# Altium schematic sheet Блок4.SchDoc
size A4
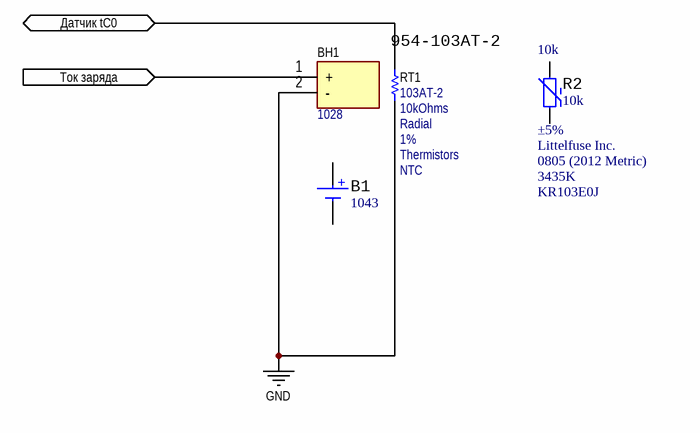
[diagram p0: Блок4.SchDoc]

## Parts
B1  1043  [KEYSTONE 1043]
BH1  1028  [1028]
R2  10k  Part Number: KR103E0J  B25/85: 3435K  Manufacturer: Littelfuse Inc.  Package / Case: 0805 (2012 Metric)  Resistance Tolerance: ±5%  [NTC 0805_2012]
RT1  103AT-2  Resistance: 10kOhms  Termination Style: Radial  Tolerance: 1%  Product Category: Thermistors  Type: NTC  Supplier Part Number 1: 954-103AT-2  [SEMI-103AT-2_V]

## Ports
Датчик tC0 (bidir), Ток заряда (in)

## Nets
GND: BH1.2(-) RT1.1
Датчик tC0: RT1.2 ; port Датчик tC0
Ток заряда: BH1.1(+) ; port Ток заряда

Not connected (* = marked no-connect by the designer): B1 1(+) 2(-); R2 1 2

## Library data of the parts
B1 = 1043: BATTERY HOLDER 18650 PC PIN; Manufacturer: Keystone Electronics; Battery Cell Size: 18650; Battery Type, Function: Cylindrical, Holder; Number of Cells: 1; Style: Holder (Open); Part Number: 1043; ComponentLink1Description: Datasheet; ComponentLink1URL: http://keyelco.com/userAssets/file/M65p27.pdf; ComponentLink2Description: DigiKey Link; ComponentLink2URL: http://digikey.com/product-detail/en/keystone-electronics/1043/36-1043-ND/2745669; Height Above Board: 0.585" (14.86mm); LastUpdated: 02.02.2020 9:19:56; Lifecycle Status: Active; Minimum Order: 1; Mounting Type: PCB, Through Hole; Operating Temperature: -50°C ~ 145°C; Packaging: Unknown; PartId: 2; Part Status: Active; Price: 2.58; Series: -; Supplier 1: DigiKey; Supplier Part Number 1: 36-1043-ND; Termination Style: PC Pin
BH1 = 1028: Undefined or Miscellaneous; Manufacturer_Name: Keystone Electronics; Datasheet Link: http://www.keyelco.com/product-pdf.cfm?p=929; Height: 15.49mm; Manufacturer_Part_Number: 1028; Mouser Part Number: 534-1028; Mouser Price/Stock: https://www.mouser.co.uk/ProductDetail/Keystone-Electronics/1028?qs=TMDrOSIpnUdoTBwO9TubhA%3D%3D; Arrow Part Number: 1028; Arrow Price/Stock: https://www.arrow.com/en/products/1028/keystone-electronics
R2 = KR103E0J: THERMISTOR NTC 10KOHM 3435K 0805; Power - Max: 300mW; ComponentLink1Description: Datasheet; ComponentLink1URL: https://www.littelfuse.com/~/media/electronics/datasheets/surface_mount_thermistors/littelfuse_surface_mount_thermistors_end_banded_chip_thermistors_0805_kr_datasheet.pdf.pdf; ComponentLink2Description: DigiKey Link; ComponentLink2URL: http://digikey.com/product-detail/en/littelfuse-inc/KR103E0J/KR103E0J-ND/4923947; LastUpdated: 30.08.2020 21:02:56; Lifecycle Status: Active; Minimum Order: 500; Mounting Type: Surface Mount; Packaging: Bulk; PartId: 1290; Price: 0.48; Resistance in Ohms @ 25°C: 10k; Series: KR; Supplier 1: DigiKey; Supplier Part Number 1: KR103E0J-ND; Value: 10k
RT1 = CMP-2000-05824-1: Precision NTC Thermistor, 10 kOhm, +/- 1%, 10 mW, -50 to 110 degC, 2-Pin THD, RoHS, Bulk; Brand: Semitec; Packaging: Bulk; Mounting Technology: ThroughHole; Operating Temperature Range: -50Cto+110C; Lead Spacing: 2.54mm; RoHS: True; Manufacturer URL: http://www.semitec.co.jp/english/; Datasheet Version: Rev. A, 02/2007; Length: 17mm; Manufacturer: Semitec; Datasheet URL: https://www.rapidonline.com/pdf/61-0500e.pdf; Series: AT; Package Description: 2-Pin Through Hole Device, Body Width 3.8 mm (Max), Pitch 2.54 mm; Width: 3.7mm; Package Reference: 103AT-2; Height: 2.4mm; Supplier 1: Mouser; Manufacturer Part Number: 103AT-2; Category: Thermistors; Stock 1: 13690; Pricing 1: 1=2,25000, 10=2,06000, 50=2,06000, 100=1,67000, 200=0,75000, 600=0,66000, 1000=0,42000, 2000=0,35400, 5000=0,34500, 10000=0,33500 (USD); Number of Pins: 2; Min Operating Temperature: -50°C; Max Operating Temperature: 110°C; Termination: Radial; Lead Pitch: 2.54mm; RoHS Compliant: Yes; ComponentLink1URL: https://datasheet.ciiva.com/4505/semitec-atthermistor-371460-4505142.pdf?src-supplier=Mouser; ComponentLink1Description: https://datasheet.ciiva.com/4505/semitec-atthermistor-371460-4505142.pdf?src-supplier=Mouser; ComponentLink2URL: https://datasheet.ciiva.com/26346/61-0500e-26346397.pdf?src-supplier=Rapid+Electronics; ComponentLink2Description: https://datasheet.ciiva.com/26346/61-0500e-26346397.pdf?src-supplier=Rapid+Electronics